# EAGLE schematic MRF24J40MA_Breakout_verC (EAGLE 6.4)
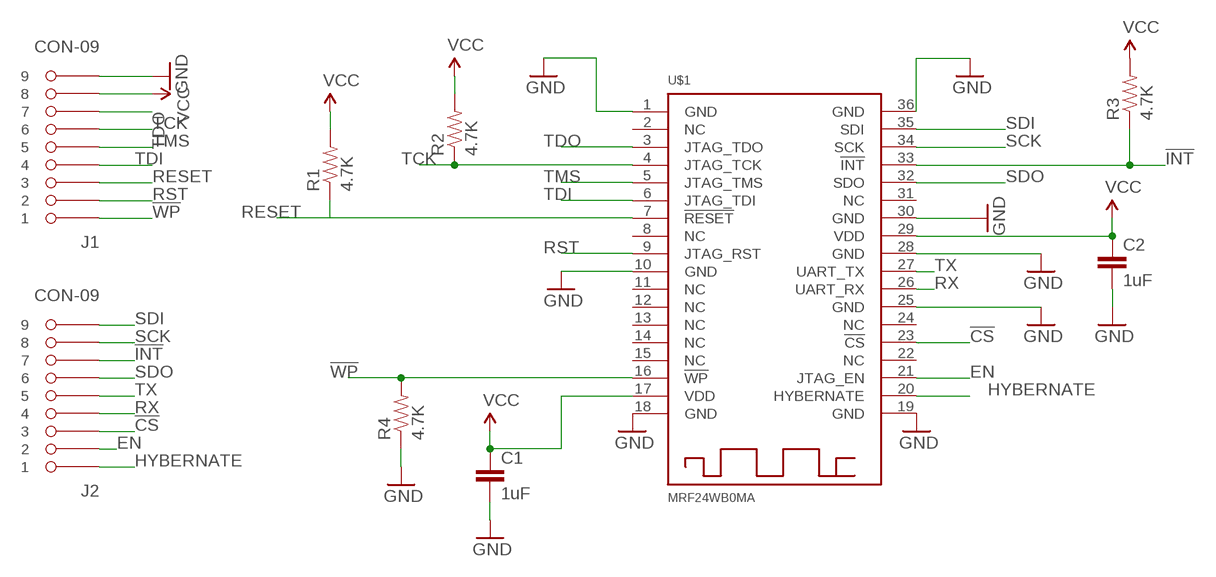
[diagram p0: schematic, sheet 1]

## Parts
C1  1uF  CAP0603-CAP  [0603-CAP]
C2  1uF  CAP0603-CAP  [0603-CAP]
J1  CON-09  [09-SMD]
J2  CON-09  [09-SMD]
R1  4.7K  RESISTOR0603-RES  [0603-RES]
R2  4.7K  RESISTOR0603-RES  [0603-RES]
R3  4.7K  RESISTOR0603-RES  [0603-RES]
R4  4.7K  RESISTOR0603-RES  [0603-RES]
U$1  MRF24WB0MA  [MRF24WB0MA]

## Nets
!CS: J2.3 U$1.23(!CS)
!INT: J2.7 R3.1 U$1.33(!INT)
!WP: J1.1 R4.2 U$1.16(!WP)
EN: J2.2 U$1.21(JTAG_EN)
GND: C1.2 C2.2 J1.9 R4.1 U$1.1(GND) U$1.10(GND) U$1.18(GND) U$1.19(GND) U$1.25(GND) U$1.28(GND) U$1.30(GND) U$1.36(GND)
HYBERNATE: J2.1 U$1.20(HYBERNATE)
RESET: J1.3 R1.1 U$1.7(!RESET)
RST: J1.2 U$1.9(JTAG_RST)
RX: J2.4 U$1.26(UART_RX)
SCK: J2.8 U$1.34(SCK)
SDI: J2.9 U$1.35(SDI)
SDO: J2.6 U$1.32(SDO)
TCK: J1.6 R2.1 U$1.4(JTAG_TCK)
TDI: J1.4 U$1.6(JTAG_TDI)
TDO: J1.7 U$1.3(JTAG_TDO)
TMS: J1.5 U$1.5(JTAG_TMS)
TX: J2.5 U$1.27(UART_TX)
VCC: C1.1 C2.1 J1.8 R1.2 R2.2 R3.2 U$1.17(VDD) U$1.29(VDD)
Unconnected: U$1.2(NC) U$1.8(NC) U$1.11(NC) U$1.12(NC) U$1.13(NC) U$1.14(NC) U$1.15(NC) U$1.22(NC) U$1.24(NC) U$1.31(NC)

## Library data of the parts
C1 C2 = SparkFun-Passives:CAP: Capacitor Standard 0603 ceramic capacitor, and 0.1" leaded capacitor.
J1 J2 = Connectors:CON-09
R1-R4 = SparkFun-Passives:RESISTOR: Resistor Basic schematic elements and footprints for 0603, 1206, and PTH resistors.
U$1 = mrf24wb0ma:MRF24WB0MA